# Altium project Energy_Monitor.PrjPcb
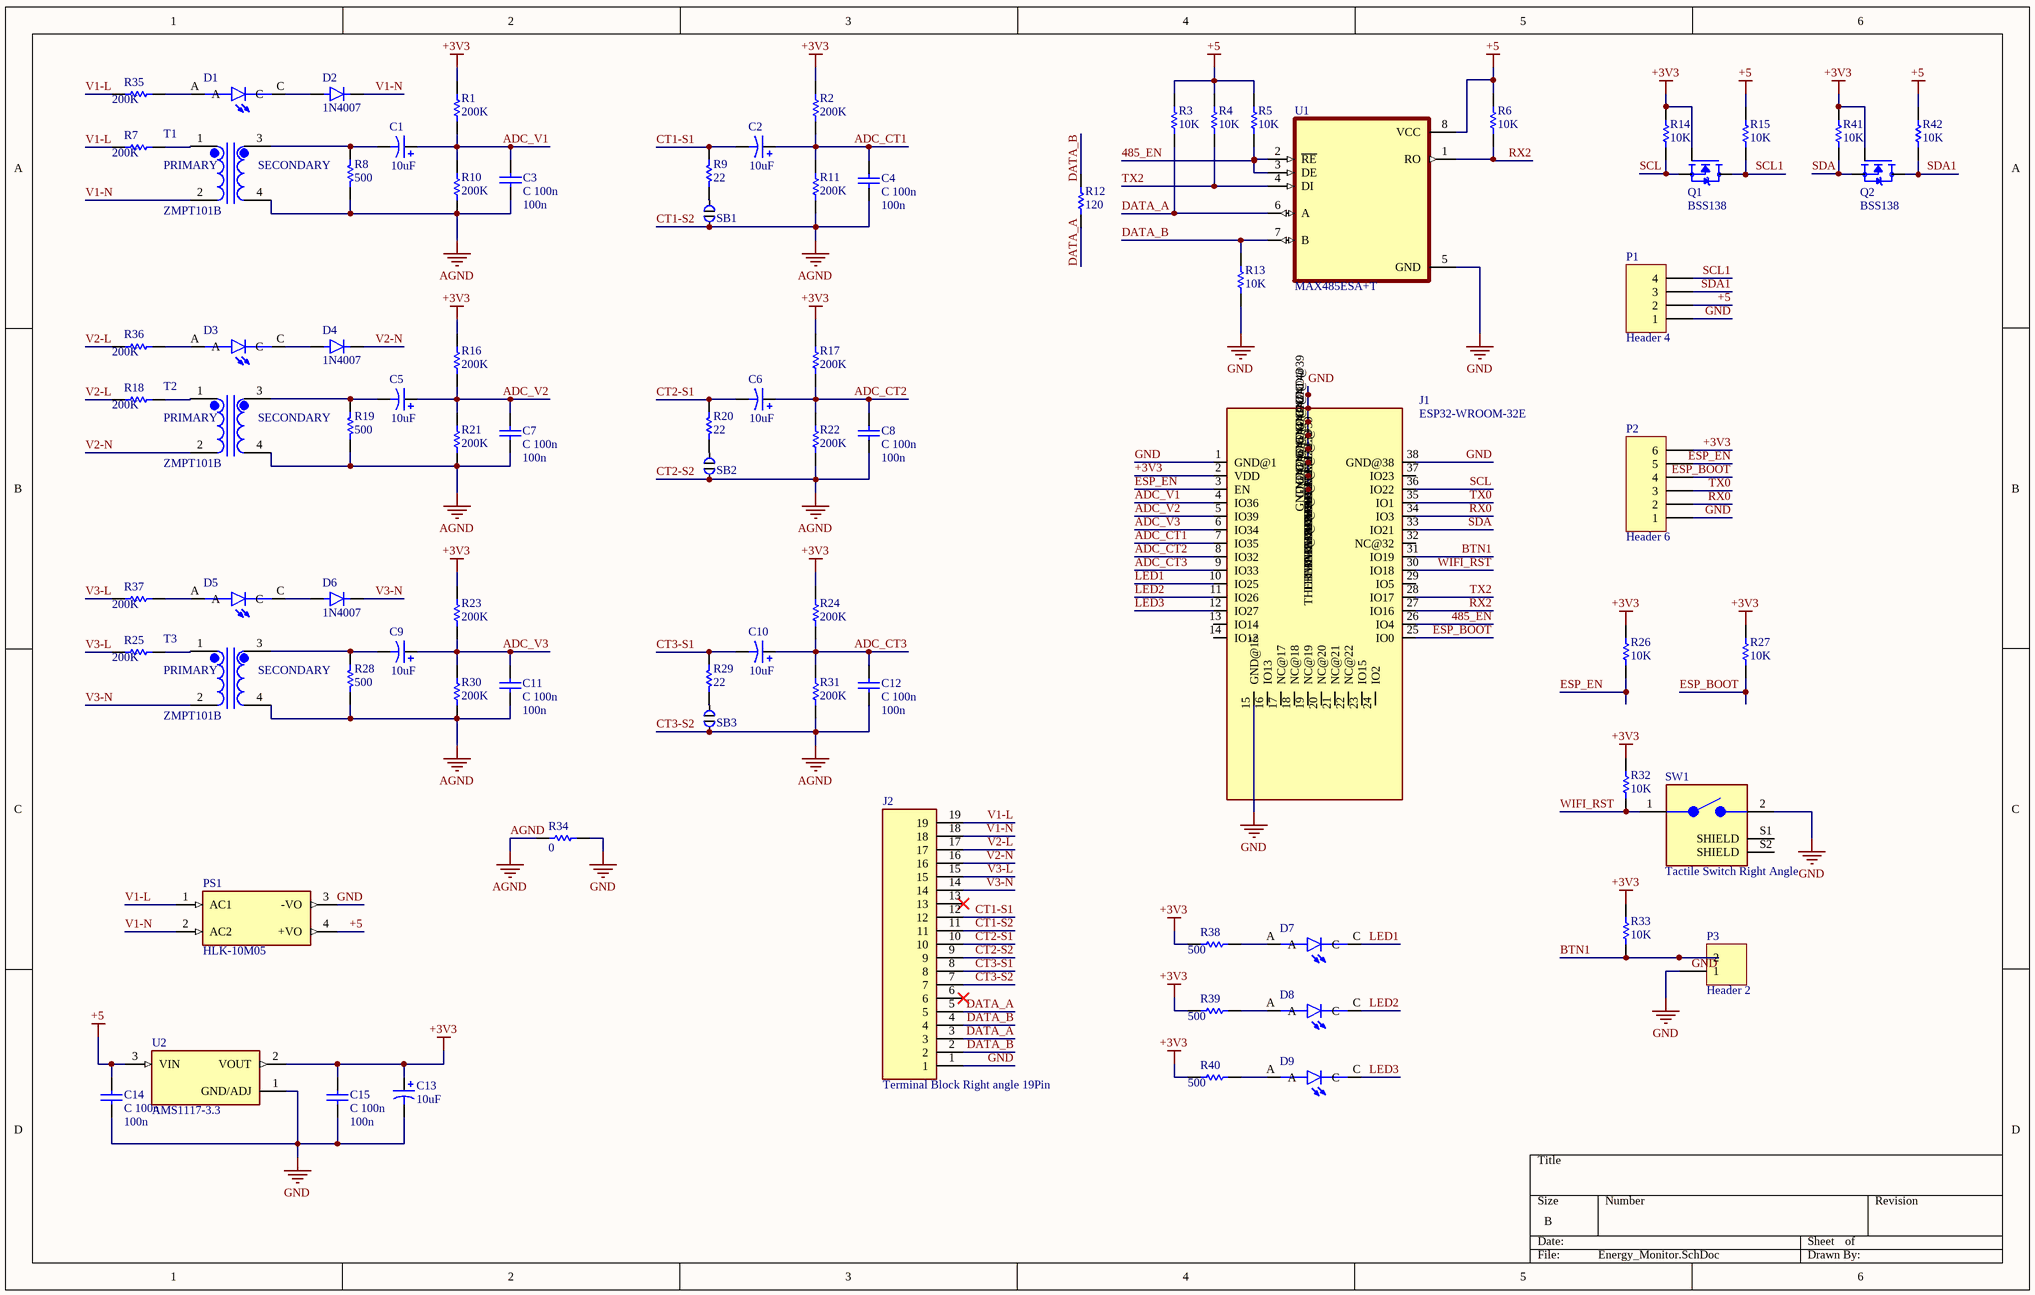
[diagram p0: Energy_Monitor.SchDoc]
1 sheet, 83 parts. Net scope: global (net labels, ports and power ports of the same name join across sheets).
Board file: Energy_Monitor.PcbDoc

## Sheet Energy_Monitor.SchDoc
size B

### Parts
C1  value 10uF  [C1206]  (hidden comment: C Tantalum 10u)
C2  value 10uF  [C1206]  (hidden comment: C Tantalum 10u)
C3  C 100n  value 100n  [6-0805_N]
C4  C 100n  value 100n  [6-0805_N]
C5  value 10uF  [C1206]  (hidden comment: C Tantalum 10u)
C6  value 10uF  [C1206]  (hidden comment: C Tantalum 10u)
C7  C 100n  value 100n  [6-0805_N]
C8  C 100n  value 100n  [6-0805_N]
C9  value 10uF  [C1206]  (hidden comment: C Tantalum 10u)
C10  value 10uF  [C1206]  (hidden comment: C Tantalum 10u)
C11  C 100n  value 100n  [6-0805_N]
C12  C 100n  value 100n  [6-0805_N]
C13  value 10uF  [C1206]  (hidden comment: C Tantalum 10u)
C14  C 100n  value 100n  [6-0805_N]
C15  C 100n  value 100n  [6-0805_N]
D1  LED 0805  [LEDC2012X70N]  (value not drawn)
D2  1N4007  [DIOM5227X270N]
D3  LED 0805  [LEDC2012X70N]  (value not drawn)
D4  1N4007  [DIOM5227X270N]
D5  LED 0805  [LEDC2012X70N]  (value not drawn)
D6  1N4007  [DIOM5227X270N]
D7  LED 0805  [LEDC2012X70N]  (value not drawn)
D8  LED 0805  [LEDC2012X70N]  (value not drawn)
D9  LED 0805  [LEDC2012X70N]  (value not drawn)
J1  ESP32-WROOM-32E  [ESP32-WROOM-32E]
J2  Terminal Block Right angle 19Pin  [CUI_TBP01R1-508-19BE]
P1  Header 4  [JST_B4B-XH-A(LF)(SN)]
P2  Header 6  [HDR1X6]
P3  Header 2  [HDR1X2]
PS1  HLK-10M05  [CONV_HLK-10M05]
Q1  BSS138  [SOT95P240X111-3N]
Q2  BSS138  [SOT95P240X111-3N]
R1  value 200K  [6-0805_N]  (hidden comment: R 200K)
R2  value 200K  [6-0805_N]  (hidden comment: R 200K)
R3  value 10K  [6-0805_N]  (hidden comment: R 10K)
R4  value 10K  [6-0805_N]  (hidden comment: R 10K)
R5  value 10K  [6-0805_N]  (hidden comment: R 10K)
R6  value 10K  [6-0805_N]  (hidden comment: R 10K)
R7  value 200K  [6-0805_N]  (hidden comment: R 200K)
R8  value 500  [6-0805_N]  (hidden comment: R 500)
R9  value 22  [6-0805_N]  (hidden comment: R 22)
R10  value 200K  [6-0805_N]  (hidden comment: R 200K)
R11  value 200K  [6-0805_N]  (hidden comment: R 200K)
R12  value 120  [6-0805_N]  (hidden comment: R 120)
R13  value 10K  [6-0805_N]  (hidden comment: R 10K)
R14  value 10K  [6-0805_N]  (hidden comment: R 10K)
R15  value 10K  [6-0805_N]  (hidden comment: R 10K)
R16  value 200K  [6-0805_N]  (hidden comment: R 200K)
R17  value 200K  [6-0805_N]  (hidden comment: R 200K)
R18  value 200K  [6-0805_N]  (hidden comment: R 200K)
R19  value 500  [6-0805_N]  (hidden comment: R 500)
R20  value 22  [6-0805_N]  (hidden comment: R 22)
R21  value 200K  [6-0805_N]  (hidden comment: R 200K)
R22  value 200K  [6-0805_N]  (hidden comment: R 200K)
R23  value 200K  [6-0805_N]  (hidden comment: R 200K)
R24  value 200K  [6-0805_N]  (hidden comment: R 200K)
R25  value 200K  [6-0805_N]  (hidden comment: R 200K)
R26  value 10K  [6-0805_N]  (hidden comment: R 10K)
R27  value 10K  [6-0805_N]  (hidden comment: R 10K)
R28  value 500  [6-0805_N]  (hidden comment: R 500)
R29  value 22  [6-0805_N]  (hidden comment: R 22)
R30  value 200K  [6-0805_N]  (hidden comment: R 200K)
R31  value 200K  [6-0805_N]  (hidden comment: R 200K)
R32  value 10K  [6-0805_N]  (hidden comment: R 10K)
R33  value 10K  [6-0805_N]  (hidden comment: R 10K)
R34  value 0  [6-0805_N]  (hidden comment: R 0)
R35  value 200K  [6-0805_N]  (hidden comment: R 200K)
R36  value 200K  [6-0805_N]  (hidden comment: R 200K)
R37  value 200K  [6-0805_N]  (hidden comment: R 200K)
R38  value 500  [6-0805_N]  (hidden comment: R 500)
R39  value 500  [6-0805_N]  (hidden comment: R 500)
R40  value 500  [6-0805_N]  (hidden comment: R 500)
R41  value 10K  [6-0805_N]  (hidden comment: R 10K)
R42  value 10K  [6-0805_N]  (hidden comment: R 10K)
SB1  solder Bridge  [Solder Bridge]  (value not drawn)
SB2  solder Bridge  [Solder Bridge]  (value not drawn)
SB3  solder Bridge  [Solder Bridge]  (value not drawn)
SW1  Tactile Switch Right Angle  [SW_1825027-5]
T1  ZMPT101B  [XFMR_ZMPT101B]
T2  ZMPT101B  [XFMR_ZMPT101B]
T3  ZMPT101B  [XFMR_ZMPT101B]
U1  MAX485ESA+T  [SOIC127P600X175-8N]
U2  AMS1117-3.3  [SOT229P700X180-4N]

### Nets
+3V3: C13.1 C15.2 J1.2(VDD) P2.6 Q1.1(G) Q2.1(G) R1.2 R2.2 R14.2 R16.2 R17.2 R23.2 R24.2 R26.2 R27.2 R32.2 R33.2 R38.1 R39.1 R40.1 R41.2 U2.2(VOUT)
+5: C14.2 P1.2 PS1.4(+VO) R3.2 R4.2 R5.2 R6.2 R15.2 R42.2 U1.8(VCC) U2.3(VIN)
AGND: C3.1 C4.1 C7.1 C8.1 C11.1 C12.1 J2.7 J2.9 J2.11 R8.1 R10.1 R11.1 R19.1 R21.1 R22.1 R28.1 R30.1 R31.1 R34.2 SB1.2 SB2.2 SB3.2 T1.4 T2.4 T3.4  [also labelled CT1-S2, CT2-S2, CT3-S2]
GND: C13.2 C14.1 C15.1 J1.1(GND@1) J1.15(GND@15) J1.38(GND@38) J1.GND@39(THERMAL@39) J1.GND@40(THERMAL@39) J1.GND@41(THERMAL@39) J1.GND@42(THERMAL@39) J1.GND@43(THERMAL@39) J1.GND@44(THERMAL@39) J1.GND@45(THERMAL@39) J1.GND@46(THERMAL@39) J1.GND@47(THERMAL@39) J2.1 P1.1 P2.1 P3.1 PS1.3(-VO) R13.1 R34.1 SW1.2 U1.5(GND) U2.1(GND/ADJ)
485_EN: J1.26(IO4) R5.1 U1.2(~{RE}) U1.3(DE)
ADC_CT1: C2.1 C4.2 J1.7(IO35) R2.1 R11.2
ADC_CT2: C6.1 C8.2 J1.8(IO32) R17.1 R22.2
ADC_CT3: C10.1 C12.2 J1.9(IO33) R24.1 R31.2
ADC_V1: C1.1 C3.2 J1.4(IO36) R1.1 R10.2
ADC_V2: C5.1 C7.2 J1.5(IO39) R16.1 R21.2
ADC_V3: C9.1 C11.2 J1.6(IO34) R23.1 R30.2
BTN1: J1.31(IO19) P3.2 R33.1
CT1-S1: C2.2 J2.12 R9.2
CT2-S1: C6.2 J2.10 R20.2
CT3-S1: C10.2 J2.8 R29.2
DATA_A: J2.3 J2.5 R3.1 R12.2 U1.6(A)
DATA_B: J2.2 J2.4 R12.1 R13.2 U1.7(B)
ESP_BOOT: J1.25(IO0) P2.4 R27.1
ESP_EN: J1.3(EN) P2.5 R26.1
LED1: D7.C J1.10(IO25)
LED2: D8.C J1.11(IO26)
LED3: D9.C J1.12(IO27)
RX0: J1.34(IO3) P2.2
RX2: J1.27(IO16) R6.1 U1.1(RO)
SCL: J1.36(IO22) Q1.2(S) R14.1
SCL1: P1.4 Q1.3(D) R15.1
SDA: J1.33(IO21) Q2.2(S) R41.1
SDA1: P1.3 Q2.3(D) R42.1
TX0: J1.35(IO1) P2.3
TX2: J1.28(IO17) R4.1 U1.4(DI)
V1-L: J2.19 PS1.1(AC1) R7.1 R35.1
V1-N: D2.C(K) J2.18 PS1.2(AC2) T1.2
V2-L: J2.17 R18.1 R36.1
V2-N: D4.C(K) J2.16 T2.2
V3-L: J2.15 R25.1 R37.1
V3-N: D6.C(K) J2.14 T3.2
WIFI_RST: J1.30(IO18) R32.1 SW1.1
NetC1_2: C1.2 R8.2 T1.3
NetC5_2: C5.2 R19.2 T2.3
NetC9_2: C9.2 R28.2 T3.3
NetD1_A: D1.A R35.2
NetD1_C: D1.C D2.A
NetD3_A: D3.A R36.2
NetD3_C: D3.C D4.A
NetD5_A: D5.A R37.2
NetD5_C: D5.C D6.A
NetD7_A: D7.A R38.2
NetD8_A: D8.A R39.2
NetD9_A: D9.A R40.2
NetR7_2: R7.2 T1.1
NetR9_1: R9.1 SB1.1
NetR18_2: R18.2 T2.1
NetR20_1: R20.1 SB2.1
NetR25_2: R25.2 T3.1
NetR29_1: R29.1 SB3.1

Not connected (* = marked no-connect by the designer): J1 13(IO14) 14(IO12) 16(IO13) 17(NC@17) 18(NC@18) 19(NC@19) 20(NC@20) 21(NC@21) 22(NC@22) 23(IO15) 24(IO2) 29(IO5) 32(NC@32) 37(IO23); J2 6* 13*; SW1 S1(SHIELD) S2(SHIELD)

### Notes on the sheet
- Labels drawn without touching a wire or pin: GND
- (in symbol ZMPT101B) PRIMARY; SECONDARY

### Library data of the parts
C1 C2 C5 C6 C9 C10 C13 = Cap Pol1: Polarized Capacitor (Radial); Published: 8-Jun-2000; LatestRevisionDate: 17-Jul-2002; LatestRevisionNote: Re-released for DXP Platform.; PackageReference: RB7.6-15; Publisher: Altium Limited; PackageDescription: Polarized Capacitor (Radial); 2 Leads
C3 C4 C7 C8 C11 C12 C14 C15 = Cap: Capacitor; Published: 8-Jun-2000; LatestRevisionDate: 17-Jul-2002; LatestRevisionNote: Re-released for DXP Platform.; PackageReference: RAD-0.3; Publisher: Altium Limited; PackageDescription: Radial Cap, Thru-Hole; 2 Leads; 0.3 in Pin Spacing
D1 D3 D5 D7-D9 = 597-3305-607F: LED Uni-Color Green 4-Pin Chip 0805 T/R; Availability: Unavailable; Value: *; Price: None; MP: 597-3305-607F; Package: None
D2 D4 D6 = S1M: Diode Standard 1000 V 1A Surface Mount DO-214AC (SMA); MF: Diotec Semiconductor; Value: *; MP: S1M; Price: None; Package: DO-214AC-2 Diotec; Availability: In Stock; SnapEDA_Link: https://www.snapeda.com/parts/S1M/Diotec/view-part/?ref=snap; Purchase-URL: https://pricing.snapeda.com/search/part/S1M/?ref=eda; Check_prices: https://www.snapeda.com/parts/S1M/Diotec/view-part/?ref=eda
J1 = ESP32-WROOM-32E: MF: Espressif Systems; Package: SMD-44 Espressif Systems; Price: None; Value: *; SnapEDA_Link: https://www.snapeda.com/parts/ESP32-WROOM-32E/Espressif+Systems/view-part/?ref=snap; MP: ESP32-WROOM-32E; Availability: In Stock; Check_prices: https://www.snapeda.com/parts/ESP32-WROOM-32E/Espressif+Systems/view-part/?ref=eda
J2 = TBP01R1-508-19BE: MP: TBP01R1-508-19BE; Value: *; Package: None; Price: None; Availability: Unavailable
P1 = Header 4: Header, 4-Pin; LatestRevisionDate: 17-Jul-2002; LatestRevisionNote: Re-released for DXP Platform.; Publisher: Altium Limited
P2 = Header 6: Header, 6-Pin; LatestRevisionDate: 17-Jul-2002; LatestRevisionNote: Re-released for DXP Platform.; Publisher: Altium Limited
P3 = Header 2: Header, 2-Pin; LatestRevisionDate: 17-Jul-2002; LatestRevisionNote: Re-released for DXP Platform.; Publisher: Altium Limited
PS1 = HLK-10M05: 10W Ultra-Compact Power Module; MF: Hi-link; SnapEDA_Link: https://www.snapeda.com/parts/HLK-10M05/Hi-link/view-part/?ref=snap; Package: Package; Value: *; MP: HLK-10M05; Check_prices: https://www.snapeda.com/parts/HLK-10M05/Hi-link/view-part/?ref=eda
Q1 Q2 = BSS138: N-Channel 50V 220mA (Ta) 360mW (Ta) Surface Mount SOT-23-3; MF: ON Semiconductor; MP: BSS138; Price: None; SnapEDA_Link: https://www.snapeda.com/parts/BSS138/ON%20Semiconductor/view-part/4794929/?ref=snap; Availability: Good; Purchase-URL: https://pricing.snapeda.com/search/part/BSS138/?ref=eda; Value: *; Check_prices: https://www.snapeda.com/parts/BSS138/ON%20Semiconductor/view-part/4794929/?ref=eda; Package: SOT-23 ON Semiconductor
R1-R42 = Res1: Resistor; Published: 8-Jun-2000; LatestRevisionDate: 17-Jul-2002; LatestRevisionNote: Re-released for DXP Platform.; PackageReference: AXIAL-0.3; Publisher: Altium Limited; PackageDescription: Axial Device, Thru-Hole; 2 Leads; 0.3 in Pin Spacing
SW1 = 1825027-5: Switch Tactile OFF (ON) SPST Round Button PC Pins 0.05A 24VDC 1.57N Thru-Hole Loose Piece; MF: TE Connectivity; SnapEDA_Link: https://www.snapeda.com/parts/1825027-5/TE+Connectivity+ALCOSWITCH+Switches/view-part/?ref=snap; Package: None; MP: 1825027-5; Check_prices: https://www.snapeda.com/parts/1825027-5/TE+Connectivity+ALCOSWITCH+Switches/view-part/?ref=eda; Purchase-URL: https://pricing.snapeda.com/search/part/1825027-5/?ref=eda; Digi-Key_Part_Number: 450-1662-ND; EU_RoHS_Compliance: Compliant; Value: *
T1-T3 = ZMPT101B: Current-type Voltage Transformer; MF: Qingxian Zeming Langxi Electronic; SnapEDA_Link: https://www.snapeda.com/parts/ZMPT101B/Qingxian+Zeming+Langxi+Electronic/view-part/?ref=snap; Package: None; MP: ZMPT101B; Check_prices: https://www.snapeda.com/parts/ZMPT101B/Qingxian+Zeming+Langxi+Electronic/view-part/?ref=eda; Price: None; Value: *; Availability: Not in stock
U1 = MAX485ESA+T: 1/1 Transceiver Half RS422, RS485 8-SOIC; MF: Maxim Integrated; MP: MAX485ESA; SnapEDA_Link: https://www.snapeda.com/parts/MAX485ESA/Maxim+Integrated/view-part/?ref=snap; Purchase-URL: https://pricing.snapeda.com/search/part/MAX485ESA/?ref=eda; Value: *; Package: SOIC-8 Maxim; Price: None; Availability: In Stock; Check_prices: https://www.snapeda.com/parts/MAX485ESA/Maxim+Integrated/view-part/?ref=eda
U2 = AMS1117-3.3: Sot223/Pkg 1-Amp 3.3-Volt Low Drop Out Voltage Regulatator; MF: Advanced Monolithic Systems; Package: SOT-223 Seeed Technology; Value: *; Check_prices: https://www.snapeda.com/parts/AMS1117-3.3/Advanced+Monolithic+Systems/view-part/?ref=eda; Price: None; Availability: Not in stock; MP: AMS1117-3.3; SnapEDA_Link: https://www.snapeda.com/parts/AMS1117-3.3/Advanced+Monolithic+Systems/view-part/?ref=snap